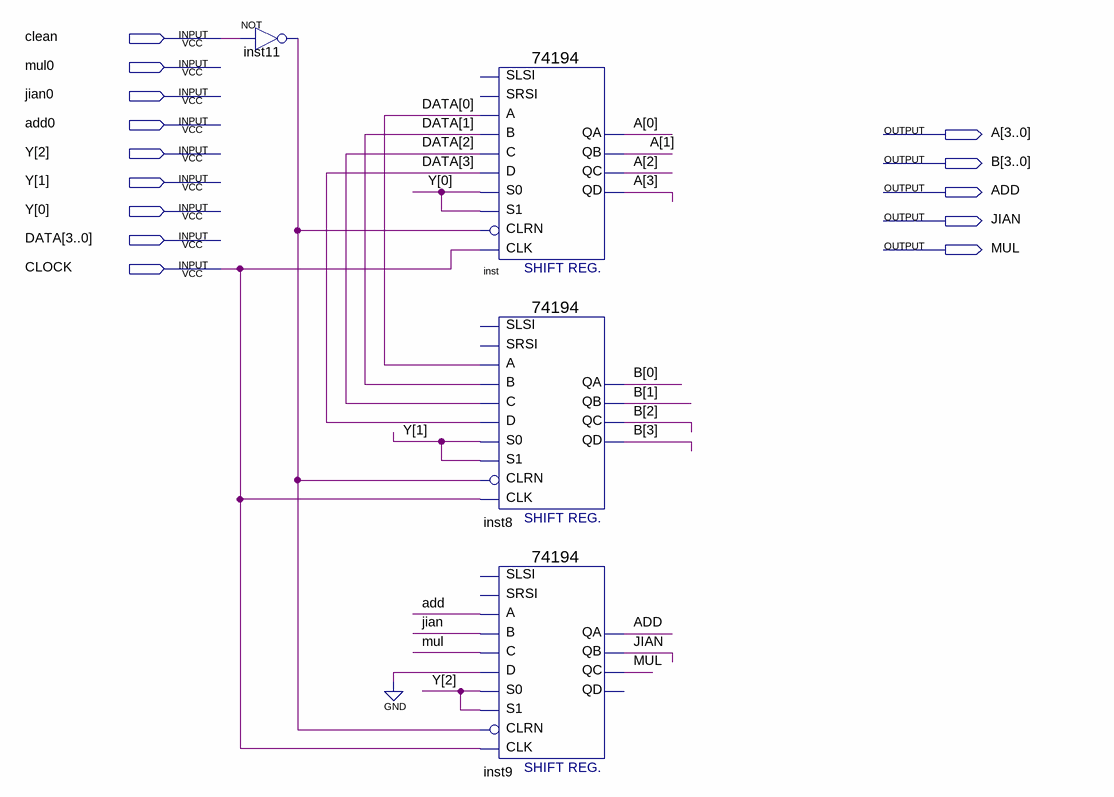
[diagram p0: schematic sheet]
// Quartus schematic jicun.bdf as structural Verilog: 4 symbols, 14 pins
module jicun (
  input  clean,
  input  mul0,
  input  jian0,
  input  add0,
  input  [2:0] Y,
  input  [3:0] DATA,
  input  CLOCK,
  output [3:0] A,
  output [3:0] B,
  output ADD,
  output JIAN,
  output MUL
);

  wire inst11_out;

  not inst11 (inst11_out, clean);
  \74194  inst (
    .B(DATA[1]), .C(DATA[2]), .CLK(CLOCK), .CLRN(inst11_out), .D(DATA[3]), .S1(Y[0]), .S0(Y[0]), .A(DATA[0]),
    .QA(A[0]), .QB(A[1]), .QC(A[2]), .QD(A[3]));  // open: SLSI, SRSI
  \74194  inst8 (
    .B(DATA[1]), .C(DATA[2]), .CLK(CLOCK), .CLRN(inst11_out), .D(DATA[3]), .S1(Y[1]), .S0(Y[1]), .A(DATA[0]),
    .QA(B[0]), .QB(B[1]), .QC(B[2]), .QD(B[3]));  // open: SLSI, SRSI
  \74194  inst9 (
    .B(JIAN), .C(MUL), .CLK(CLOCK), .CLRN(inst11_out), .D(1'b0), .S1(Y[2]), .S0(Y[2]), .A(ADD), .QA(ADD),
    .QB(JIAN), .QC(MUL));  // open: SLSI, SRSI, QD
endmodule
